# EAGLE schematic Works_002 (EAGLE 8.2.1)
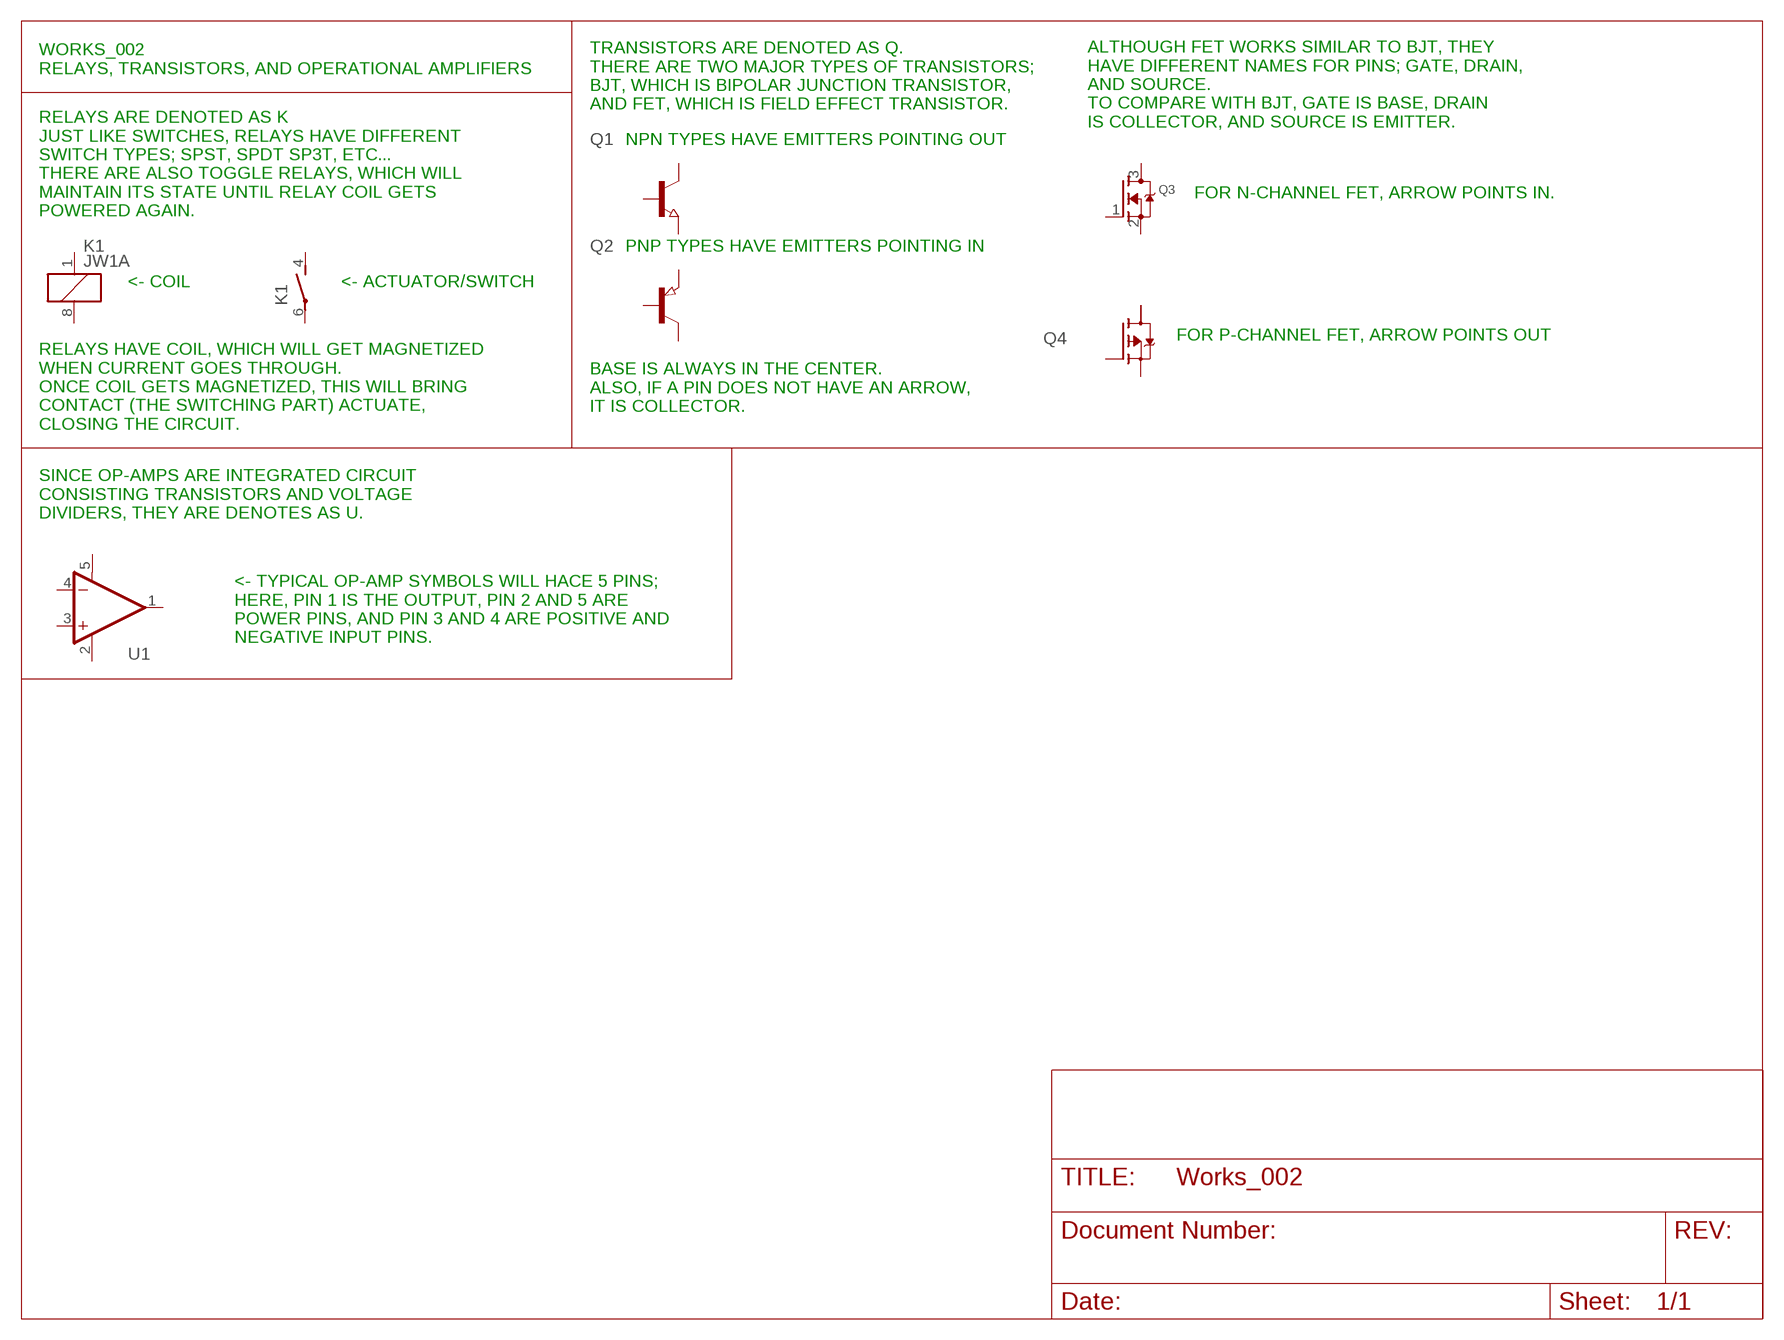
[diagram p0: schematic, sheet 1]

## Parts
K1  JW1A  [JW1A]
Q1  NPN-TRANSISTOR_SOT23  [SOT23]
Q2  PNP-TRANSISTOR_SOT23  [SOT23]
Q3  MOSFET-NREFLOW  [SOT23]
Q4  BSP613P  [PG-SOT-223]
U1  MCP6291T-E/OT  [SOT23-5]
Unconnected: K1.1 K1.4(1:S) K1.6(1:P) K1.8 Q1.1(B) Q1.2(E) Q1.3(C) Q2.1(B) Q2.2(E) Q2.3(C) Q3.1(G) Q3.2(S) Q3.3(D) Q4.1(G) Q4.2(D) Q4.3(S) Q4.4(D) U1.1(OUT) U1.3(+IN) U1.4(-IN)

## Notes on the sheet
- WORKS_002
  RELAYS, TRANSISTORS, AND OPERATIONAL AMPLIFIERS
- TRANSISTORS ARE DENOTED AS Q.
  THERE ARE TWO MAJOR TYPES OF TRANSISTORS;
  BJT, WHICH IS BIPOLAR JUNCTION TRANSISTOR,
  AND FET, WHICH IS FIELD EFFECT TRANSISTOR.
- ALTHOUGH FET WORKS SIMILAR TO BJT, THEY
  HAVE DIFFERENT NAMES FOR PINS; GATE, DRAIN,
  AND SOURCE.
  TO COMPARE WITH BJT, GATE IS BASE, DRAIN
  IS COLLECTOR, AND SOURCE IS EMITTER.
- NPN TYPES HAVE EMITTERS POINTING OUT
- FOR N-CHANNEL FET, ARROW POINTS IN.
- RELAYS ARE DENOTED AS K
  JUST LIKE SWITCHES, RELAYS HAVE DIFFERENT
  SWITCH TYPES; SPST, SPDT SP3T, ETC...
  THERE ARE ALSO TOGGLE RELAYS, WHICH WILL
  MAINTAIN ITS STATE UNTIL RELAY COIL GETS
  POWERED AGAIN.
- PNP TYPES HAVE EMITTERS POINTING IN
- <- COIL | <- ACTUATOR/SWITCH
- FOR P-CHANNEL FET, ARROW POINTS OUT
- BASE IS ALWAYS IN THE CENTER.
  ALSO, IF A PIN DOES NOT HAVE AN ARROW,
  IT IS COLLECTOR.
- RELAYS HAVE COIL, WHICH WILL GET MAGNETIZED 
  WHEN CURRENT GOES THROUGH.
  ONCE COIL GETS MAGNETIZED, THIS WILL BRING
  CONTACT (THE SWITCHING PART) ACTUATE, 
  CLOSING THE CIRCUIT.
- SINCE OP-AMPS ARE INTEGRATED CIRCUIT
  CONSISTING TRANSISTORS AND VOLTAGE
  DIVIDERS, THEY ARE DENOTES AS U.
- <- TYPICAL OP-AMP SYMBOLS WILL HACE 5 PINS;
  HERE, PIN 1 IS THE OUTPUT, PIN 2 AND 5 ARE 
  POWER PINS, AND PIN 3 AND 4 ARE POSITIVE AND
  NEGATIVE INPUT PINS.

## Power pins joined to a net without a drawn wire
V+: U1.5(V+)
V-: U1.2(V-)

## Library data of the parts
K1 = relay:JW1A: Power relay Source: Panasonic Electric Works Co., Ltd. / jw.catalog.pdf
Q1 = semicon-smd-ipc:NPN-TRANSISTOR_: NPN TRANSISTOR
Q2 = semicon-smd-ipc:PNP-TRANSISTOR_: PNP TRANSISTOR
Q3 = adafruit:MOSFET-N: N-Channel Mosfet 2N7002E - 60V 260mA SOT23 [Digikey: 2N7002ET1GOSTR-ND] - REEL BSH103 - 30V 850mA SOT23 [Digikey: 568-5013-1-ND]
Q4 = infineon:BSP613P: SIPMOS (R) Small-Signal-Transistor P-Channel (2 Drain) Source: http://www.infineon.com/dgdl/BSP613P_Rev2.4.pdf; OC_FARNELL: unknown; OC_NEWARK: unknown
U1 = SparkFun-Retired:MCP6291: Rail to rail OpAmp with 10MHz GBP Prototype: IC-11991; PROD_ID: IC-11991; VALUE: MCP6291T